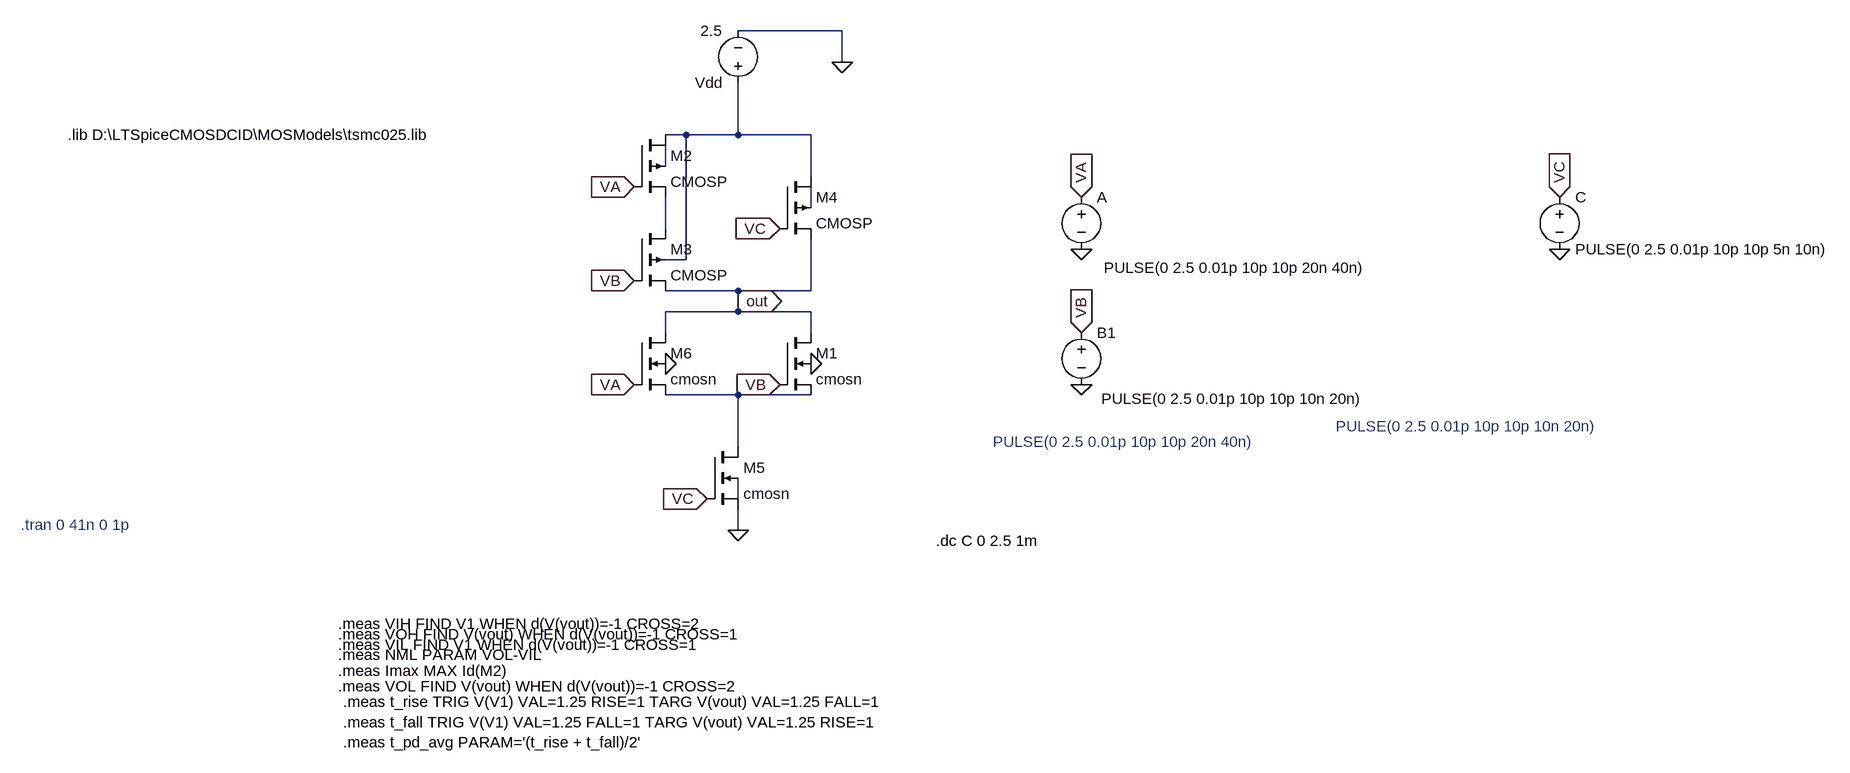
[diagram p0: schematic ress.asc]
ress.asc, the LTspice schematic file:
Version 4
SHEET 1 2744 680
WIRE 1184 -512 1024 -512
WIRE 1184 -464 1184 -512
WIRE 944 -352 912 -352
WIRE 1024 -352 1024 -432
WIRE 1024 -352 944 -352
WIRE 1136 -352 1024 -352
WIRE 912 -304 912 -336
WIRE 1136 -288 1136 -352
WIRE 1136 -240 1136 -272
WIRE 912 -208 912 -256
WIRE 944 -160 944 -352
WIRE 944 -160 912 -160
WIRE 1024 -112 912 -112
WIRE 1136 -112 1136 -192
WIRE 1136 -112 1024 -112
WIRE 1024 -96 1024 -112
WIRE 1024 -80 1024 -96
WIRE 1024 -80 912 -80
WIRE 1136 -80 1024 -80
WIRE 912 -48 912 -80
WIRE 1136 -48 1136 -80
WIRE 1024 48 912 48
WIRE 1136 48 1024 48
WIRE 1024 128 1024 48
WIRE 1024 208 1024 176
WIRE 1024 256 1024 224
FLAG 1024 256 0
FLAG 1184 -464 0
FLAG 912 0 0
FLAG 1136 0 0
FLAG 1552 -256 VA
IOPIN 1552 -256 In
FLAG 2288 -256 VC
IOPIN 2288 -256 In
FLAG 1552 -176 0
FLAG 2288 -176 0
FLAG 864 -272 VA
IOPIN 864 -272 In
FLAG 864 -128 VB
IOPIN 864 -128 In
FLAG 1088 -208 VC
IOPIN 1088 -208 In
FLAG 864 32 VA
IOPIN 864 32 In
FLAG 1088 32 VB
IOPIN 1088 32 In
FLAG 976 208 VC
IOPIN 976 208 In
FLAG 1024 -96 out
IOPIN 1024 -96 Out
FLAG 1552 -48 VB
IOPIN 1552 -48 In
FLAG 1552 32 0
SYMBOL nmos4 1088 -48 R0
SYMATTR InstName M1
SYMATTR Value cmosn
SYMATTR Value2 l=250n w=360n ad=0.1728p as=0.1728p pd=1680n ps=1680n
SYMBOL voltage 1024 -416 R180
WINDOW 123 0 0 Left 0
WINDOW 39 0 0 Left 0
SYMATTR InstName Vdd
SYMATTR Value 2.5
SYMBOL cmosp 864 -352 R0
SYMATTR InstName M2
SYMATTR Value2 l=250n w=360n ad=0.1728p as=0.1728p pd=1680n ps=1680n
SYMBOL cmosp 864 -208 R0
SYMATTR InstName M3
SYMATTR Value2 l=250n w=360n ad=0.1728p as=0.1728p pd=1680n ps=1680n
SYMBOL cmosp 1088 -288 R0
SYMATTR InstName M4
SYMATTR Value2 l=250n w=360n ad=0.1728p as=0.1728p pd=1680n ps=1680n
SYMBOL nmos4 976 128 R0
SYMATTR InstName M5
SYMATTR Value cmosn
SYMATTR Value2 l=250n w=360n ad=0.1728p as=0.1728p pd=1680n ps=1680n
SYMBOL nmos4 864 -48 R0
SYMATTR InstName M6
SYMATTR Value cmosn
SYMATTR Value2 l=250n w=360n ad=0.1728p as=0.1728p pd=1680n ps=1680n
SYMBOL voltage 1552 -272 R0
WINDOW 3 35 124 Left 2
WINDOW 123 0 0 Left 0
WINDOW 39 0 0 Left 0
SYMATTR InstName A
SYMATTR Value PULSE(0 2.5 0.01p 10p 10p 20n 40n)
SYMBOL voltage 2288 -272 R0
SYMATTR InstName C
SYMATTR Value PULSE(0 2.5 0.01p 10p 10p 5n 10n)
SYMBOL voltage 1552 -64 R0
WINDOW 3 31 118 Left 2
SYMATTR InstName B1
SYMATTR Value PULSE(0 2.5 0.01p 10p 10p 10n 20n)
TEXT -8 -352 Left 2 !.lib D:\\LTSpiceCMOSDCID\\MOSModels\\tsmc025.lib
TEXT 408 496 Left 2 !.meas VOL FIND V(vout) WHEN d(V(vout))=-1 CROSS=2
TEXT 408 400 Left 2 !.meas VIH FIND V1 WHEN d(V(vout))=-1 CROSS=2
TEXT 408 416 Left 2 !.meas VOH FIND V(vout) WHEN d(V(vout))=-1 CROSS=1
TEXT 408 432 Left 2 !.meas VIL FIND V1 WHEN d(V(vout))=-1 CROSS=1
TEXT 408 448 Left 2 !.meas NML PARAM VOL-VIL
TEXT 408 472 Left 2 !.meas Imax MAX Id(M2)
TEXT 416 520 Left 2 !.meas t_rise TRIG V(V1) VAL=1.25 RISE=1 TARG V(vout) VAL=1.25 FALL=1\n.meas t_fall TRIG V(V1) VAL=1.25 FALL=1 TARG V(vout) VAL=1.25 RISE=1\n.meas t_pd_avg PARAM='(t_rise + t_fall)/2'
TEXT -80 248 Left 2 ;.tran 0 41n 0 1p
TEXT 1328 272 Left 2 !.dc C 0 2.5 1m
TEXT 1416 120 Left 2 ;PULSE(0 2.5 0.01p 10p 10p 20n 40n)
TEXT 1944 96 Left 2 ;PULSE(0 2.5 0.01p 10p 10p 10n 20n)

The netlist it stands for:
* ress.asc
M1 out VB N005 0 cmosn l=250n w=360n ad=0.1728p as=0.1728p pd=1680n ps=1680n
Vdd N001 0 2.5
M2 N001 VA N004 N002 CMOSP l=250n w=360n ad=0.1728p as=0.1728p pd=1680n ps=1680n
M3 N004 VB out N001 CMOSP l=250n w=360n ad=0.1728p as=0.1728p pd=1680n ps=1680n
M4 N001 VC out N003 CMOSP l=250n w=360n ad=0.1728p as=0.1728p pd=1680n ps=1680n
M5 N005 VC 0 N006 cmosn l=250n w=360n ad=0.1728p as=0.1728p pd=1680n ps=1680n
M6 out VA N005 0 cmosn l=250n w=360n ad=0.1728p as=0.1728p pd=1680n ps=1680n
V§A VA 0 PULSE(0 2.5 0.01p 10p 10p 20n 40n)
V§C VC 0 PULSE(0 2.5 0.01p 10p 10p 5n 10n)
V§B1 VB 0 PULSE(0 2.5 0.01p 10p 10p 10n 20n)
.model NMOS NMOS
.model PMOS PMOS
.lib standard.mos
.lib D:\LTSpiceCMOSDCID\MOSModels\tsmc025.lib
.meas VOL FIND V(vout) WHEN d(V(vout))=-1 CROSS=2
.meas VIH FIND V1 WHEN d(V(vout))=-1 CROSS=2
.meas VOH FIND V(vout) WHEN d(V(vout))=-1 CROSS=1
.meas VIL FIND V1 WHEN d(V(vout))=-1 CROSS=1
.meas NML PARAM VOL-VIL
.meas Imax MAX Id(M2)
.meas t_rise TRIG V(V1) VAL=1.25 RISE=1 TARG V(vout) VAL=1.25 FALL=1
.meas t_fall TRIG V(V1) VAL=1.25 FALL=1 TARG V(vout) VAL=1.25 RISE=1
.meas t_pd_avg PARAM='(t_rise + t_fall)/2'
* .tran 0 41n 0 1p
.dc C 0 2.5 1m
* PULSE(0 2.5 0.01p 10p 10p 20n 40n)
* PULSE(0 2.5 0.01p 10p 10p 10n 20n)
.backanno
.end